# EAGLE design Boost_Controller (EAGLE 7.1.0)
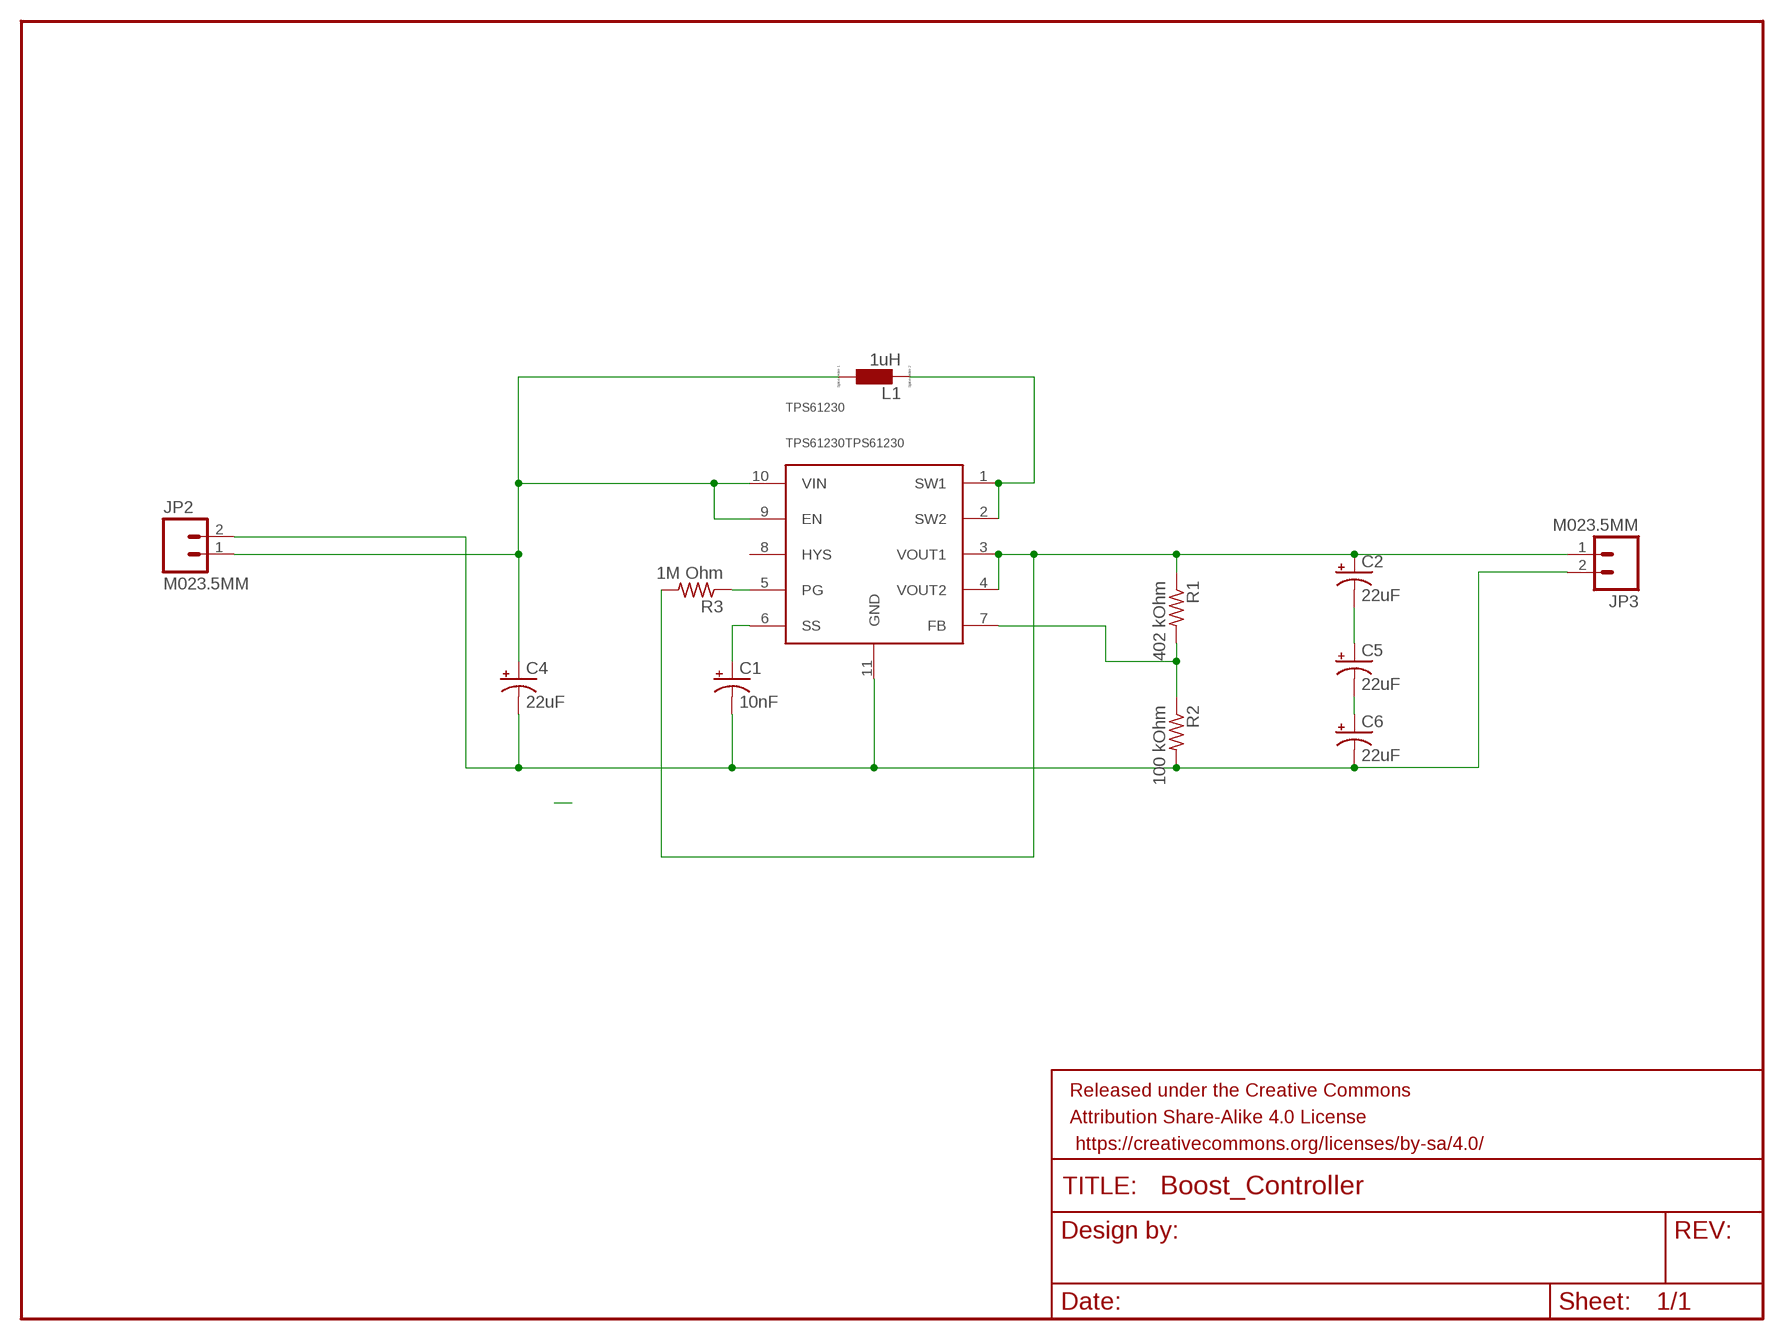
[diagram p0: schematic, sheet 1]

## Parts
C1  10nF  CPOL-USE2.5-5  [E2,5-5]
C2  22uF  CPOL-USE2.5-5  [E2,5-5]
C4  22uF  CPOL-USE2.5-5  [E2,5-5]
C5  22uF  CPOL-USE2.5-5  [E2,5-5]
C6  22uF  CPOL-USE2.5-5  [E2,5-5]
FRAME1  FRAME-LETTER  [CREATIVE_COMMONS]
JP2  M023.5MM  [SCREWTERMINAL-3.5MM-2]
JP3  M023.5MM  [SCREWTERMINAL-3.5MM-2]
L1  1uH  L0207/10  [0207/10]
R1  402 kOhm  R-US_0207/10  [0207/10]
R2  100 kOhm  R-US_0207/10  [0207/10]
R3  1M Ohm  R-US_0207/10  [0207/10]
TPS61230  TPS61230TPS61230  [SON50P300X300X100-11N]

## Nets
N$1: C1.- C4.- C6.- JP2.2 JP3.2 R2.2 TPS61230.11(GND)
N$2: R3.1 TPS61230.5(PG)
N$3: L1.2 TPS61230.1(SW1) TPS61230.2(SW2)
N$4: C2.+ JP3.1 R1.1 R3.2 TPS61230.3(VOUT1) TPS61230.4(VOUT2)
N$7: C1.+ TPS61230.6(SS)
N$8: C4.+ JP2.1 L1.1 TPS61230.9(EN) TPS61230.10(VIN)
N$9: C5.- C6.+
N$10: C2.- C5.+
N$11: R1.2 R2.1 TPS61230.7(FB)
Unconnected: TPS61230.8(HYS)

## Library data of the parts
C1 C2 C4-C6 = adafruit:CPOL-US: POLARIZED CAPACITOR, American symbol
FRAME1 = SparkFun-Aesthetics:FRAME-LETTER: Schematic Frame Standard 8.5x11 US Letter frame
JP2 JP3 = SparkFun-Connectors:M02: Standard 2-pin 0.1" header. Use with - straight break away headers ( PRT-00116) - right angle break away headers (PRT-00553) - swiss pins (PRT-00743) - machine pins (PRT-00117) - female headers (PRT-00115) Molex polarized connector foot print use with: PRT-08233 with associated crimp pins and housings. 2.54_SCREWTERM for use with PRT-10571. 3.5mm Screw Terminal footprints for PRT-08084 5mm Screw Terminal footprints for use with PRT-08432
L1 = eagle-ltspice:L: INDUCTOR, European symbol; SPICEMODEL: NONE; SPICEPREFIX: L
R1-R3 = adafruit:R-US_: RESISTOR, American symbol
TPS61230 = TPS61230:TPS61230

## Board
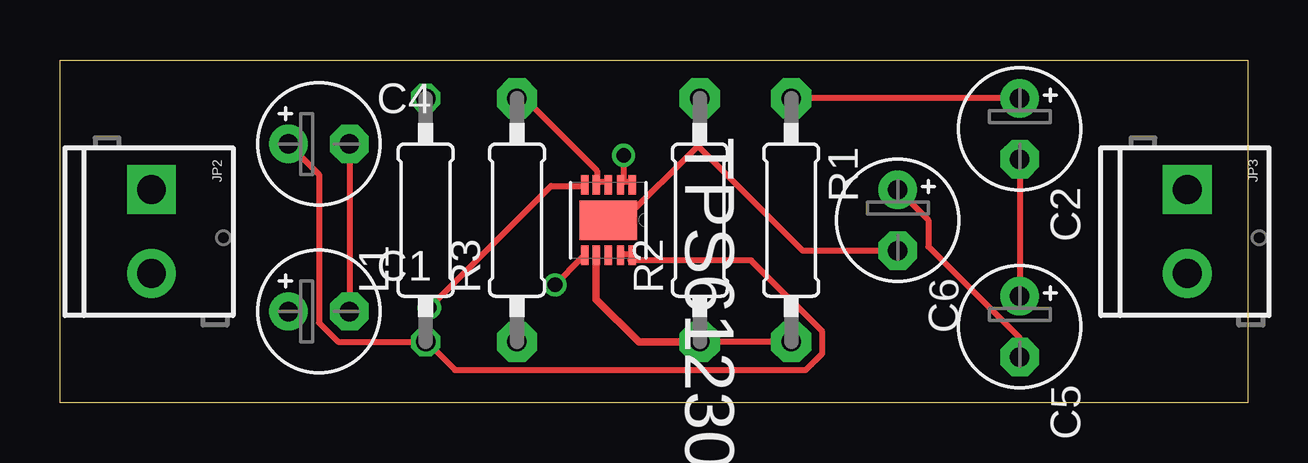
[diagram p1: board, top side]
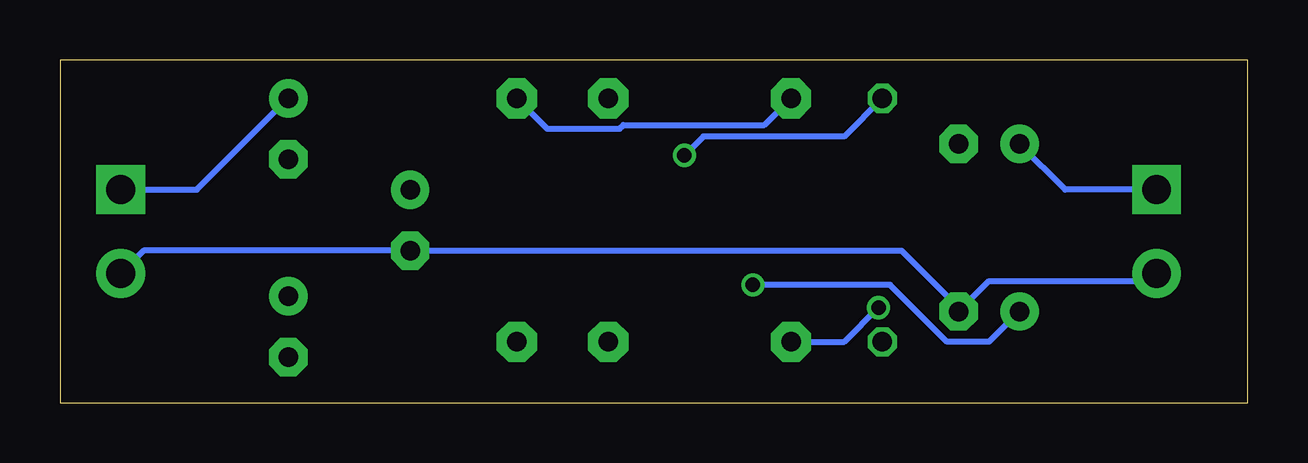
[diagram p2: board, bottom side, seen from below]

Size 49.52 x 14.3 mm. Coordinates in mm from the lower left corner, seen from the top.
Outline: 0,0 0,14.3 49.52,14.3 49.52,0 0,0
Copper layers (1*16): Top 0.0356mm / dielectric 1.5011mm / Bottom 0.0356mm
Design rules "LaenPCBOrder": minimum track width 6mil, minimum drill 13mil, track to track 6mil, track to pad 6mil, pad to pad 6mil, via to via 6mil, smd to smd 6mil, copper to edge 15mil, drill to drill 6mil, minimum pad ring 7mil, minimum via ring 7mil, stop-mask expansion 3mil, vias tented up to drill 0mil, thermal gap 10mil

### Footprints (pad centres in the part's own frame; a part is rotated, then mirrored left to right if it is on the bottom)
E2,5-5 = drill 0.813 pad 1.6: + -1.27,0 | drill 0.813 pad 1.6 octagon: - 1.27,0
SCREWTERMINAL-3.5MM-2 = drill 1.2 pad 2.032 square: 1 0,0 | drill 1.2 pad 2.032: 2 3.5,0
0207/10 = drill 0.813 octagon: 1 -5.08,0; 2 5.08,0
0207/10' = drill 0.813 pad 1.676 octagon: 1 -5.08,0; 2 5.08,0
SON50P300X300X100-11N = smd 0.813 x 0.305: 1 -1.473,0.991; 2 -1.473,0.508; 3 -1.473,0; 4 -1.473,-0.508; 5 -1.473,-0.991; 6 1.473,-0.991; 7 1.473,-0.508; 8 1.473,0; 9 1.473,0.508; 10 1.473,0.991 | smd 1.651 x 2.388: 11 0,0

### Placement (x,y rotation side)
C1  10.79,3.81 0 top
C2  40.01,11.43 270 top
C4  10.79,10.79 0 top
C5  40.01,3.17 270 top
C6  34.92,7.62 270 top
FRAME1  29.21,-10.16 0 top  (outside the outline)
JP2  3.81,8.89 270 top
JP3  46.99,8.89 270 top
L1  15.24,7.62 90 top
R1  402 kOhm  [0207/10']  30.48,7.62 270 top
R2  100 kOhm  [0207/10']  26.67,7.62 90 top
R3  1M Ohm  [0207/10']  19.05,7.62 90 top
TPS61230  22.86,7.62 270 top

### Tracks (layer width: path | path; a pad name or v marks a point on that pad's centre or on a via)
N$1
  Top 0.254: C4.- C1.- | TPS61230.11 23.5,7.62 26.59,10.72 | 26.59,10.72 26.67,10.79 R2.2 | C6.- 30.96,6.35 26.59,10.72
  Bottom 0.254: JP2.2 3.81,5.24 3.97,5.08 10.79,5.08 C1.- 12.06,3.97 14.45,6.35 C6.- 46.04,6.35 JP3.2
N$2  (via drill 0.61)
  Top 0.254: v15.4,3.97 20.48,9.05 21.75,9.05 TPS61230.5
  Bottom 0.254: v15.4,3.97 16.83,2.54 R3.1
N$3  (via drill 0.61)
  Top 0.254: 23.5,9.21 23.81,9.21 TPS61230.1 | v23.5,10.32 23.5,9.21 | 23.5,9.21 TPS61230.2
  Bottom 0.254: v23.5,10.32 22.7,11.11 16.83,11.11 L1.2
N$4
  Top 0.254: 22.38,9.21 22.86,9.21 TPS61230.3 | 22.38,9.21 22.38,9.68 19.37,12.7 R3.2 | 22.38,9.21 TPS61230.4 | C2.+ R1.1
  Bottom 0.254: C2.+ 43.81,8.89 JP3.1 | R3.2 20.16,11.59 26.04,11.59 26.19,11.43 29.21,11.43 R1.1
N$7  (via drill 0.61)
  Top 0.254: v20.64,4.92 21.75,6.03 TPS61230.6
  Bottom 0.254: v20.64,4.92 14.92,4.92 12.54,2.54 10.79,2.54 C1.+
N$8
  Top 0.254: TPS61230.9 23.5,6.19 23.81,6.19 TPS61230.10 23.77,5.94 28.8,5.94 31.77,2.97 31.77,2.06 31.09,1.37 16.46,1.37 15.32,2.52 L1.1 11.59,2.54 10.79,3.33 10.79,9.53 C4.+
  Bottom 0.254: C4.+ 7.62,8.89 JP2.1
N$9
  Top 0.254: C5.- 40.01,2.7 36.2,6.51 36.2,7.62 C6.+
N$10
  Top 0.254: C2.- C5.+
N$11
  Top 0.254: R1.2 R2.1
  Top 0.305: TPS61230.7 22.35,4.32 24.13,2.54 R2.1